# Altium project ProtoStack_Codec.PrjPcb
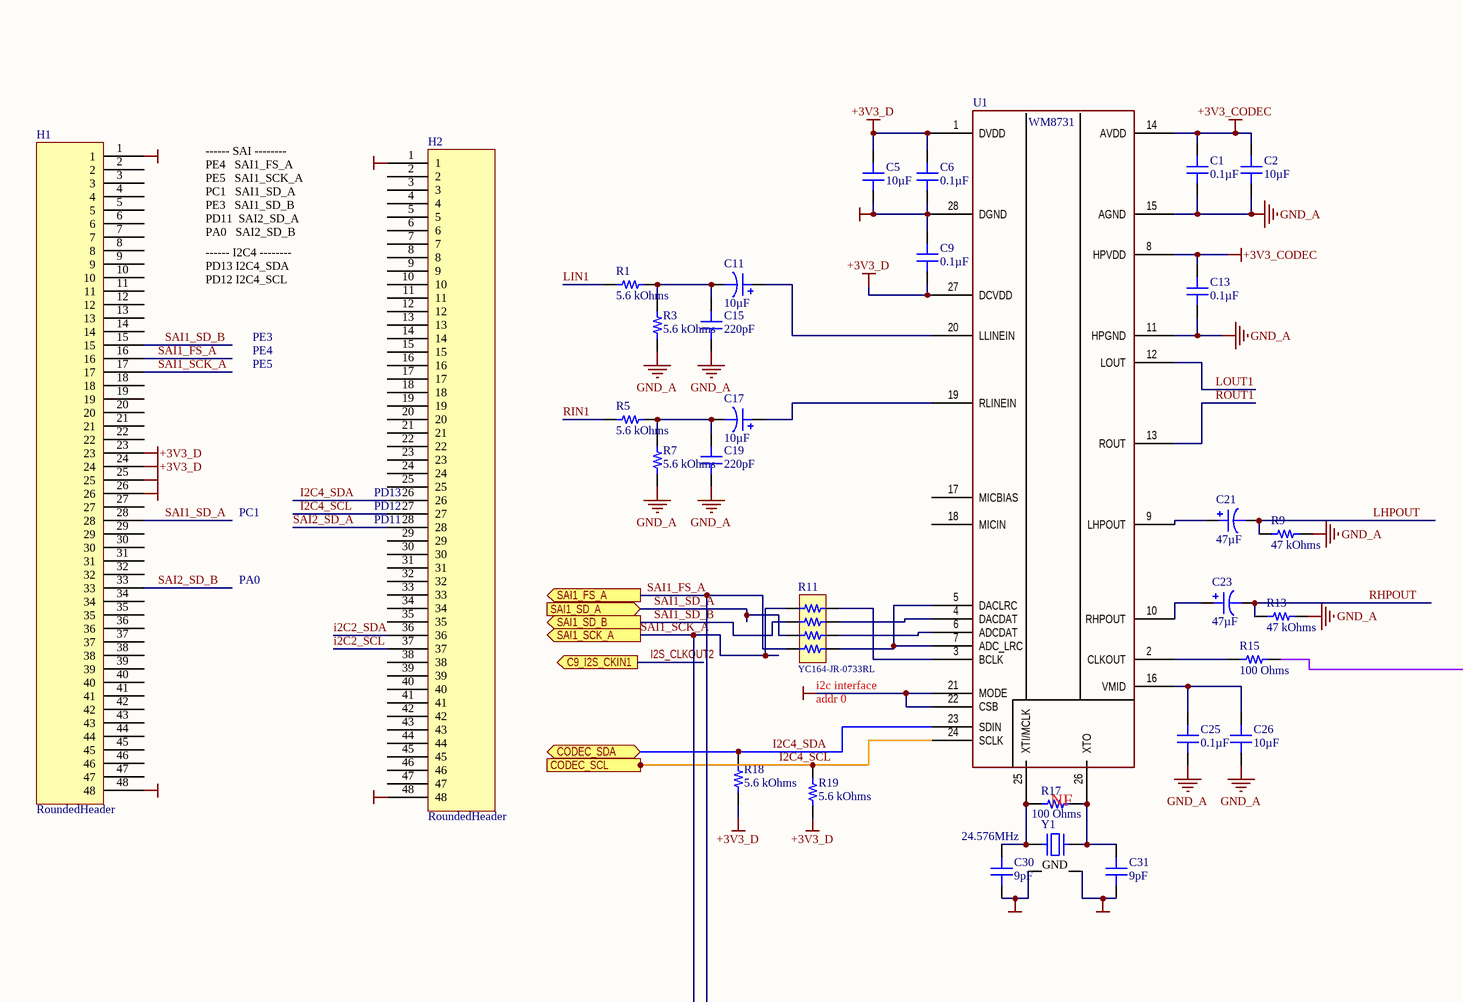
[diagram p0: ProtoStack_Codec.SchDoc, left]
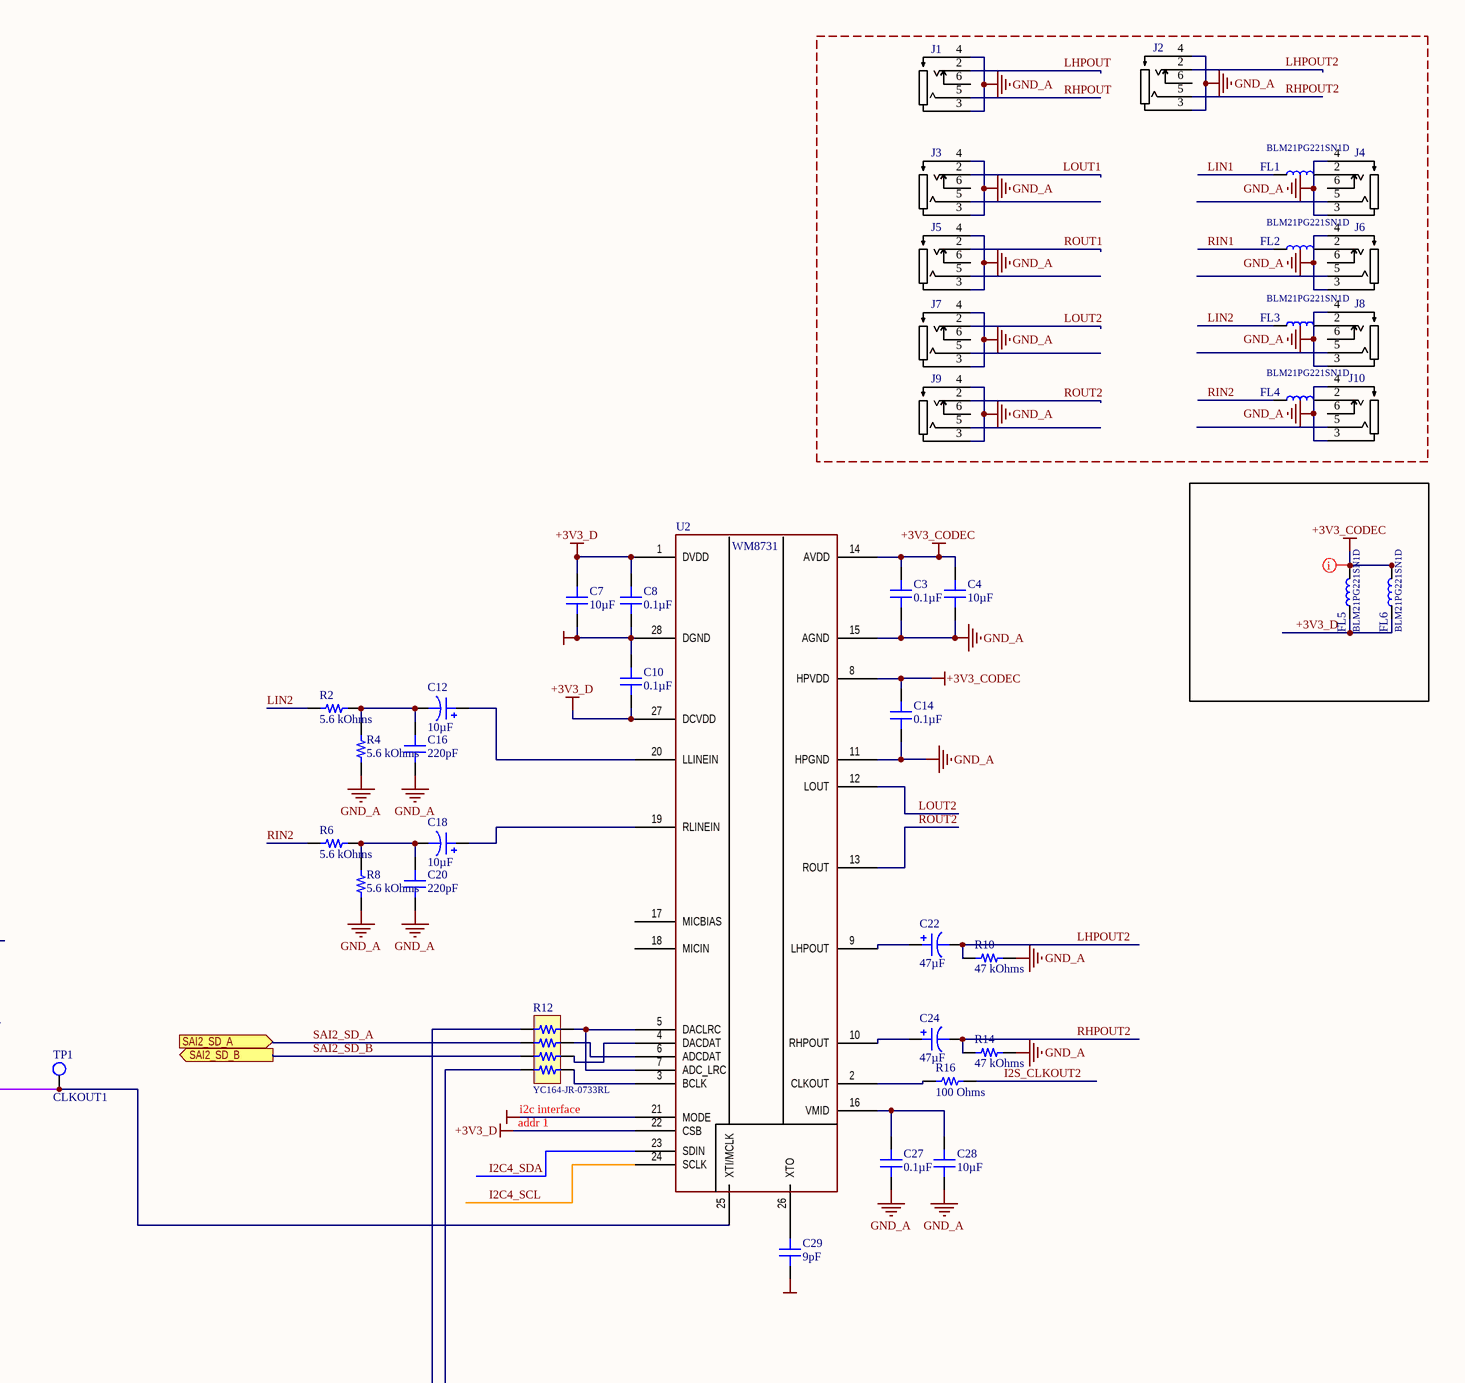
[diagram p1: ProtoStack_Codec.SchDoc, right]
1 sheet, 72 parts. Net scope: flat (ports and power ports of the same name join across sheets).
Board file: ProtoStack_Codec.PcbDoc

## Sheet ProtoStack_Codec.SchDoc
size A2; SheetNumber: 1; SheetTotal: 1

### Parts
C1  0.1µF  [CAP 0402_1005]
C2  10µF  [CAP 0805_2012]
C3  0.1µF  [CAP 0402_1005]
C4  10µF  [CAP 0805_2012]
C5  10µF  [CAP 0805_2012]
C6  0.1µF  [CAP 0402_1005]
C7  10µF  [CAP 0805_2012]
C8  0.1µF  [CAP 0402_1005]
C9  0.1µF  [CAP 0402_1005]
C10  0.1µF  [CAP 0402_1005]
C11  10µF  [CAP POL 1206_3216]
C12  10µF  [CAP POL 1206_3216]
C13  0.1µF  [CAP 0402_1005]
C14  0.1µF  [CAP 0402_1005]
C15  220pF  [CAP 0603_1608]
C16  220pF  [CAP 0603_1608]
C17  10µF  [CAP POL 1206_3216]
C18  10µF  [CAP POL 1206_3216]
C19  220pF  [CAP 0603_1608]
C20  220pF  [CAP 0603_1608]
C21  47µF  [CAP POL 2917_7343]
C22  47µF  [CAP POL 2917_7343]
C23  47µF  [CAP POL 2917_7343]
C24  47µF  [CAP POL 2917_7343]
C25  0.1µF  [CAP 0402_1005]
C26  10µF  [CAP 0805_2012]
C27  0.1µF  [CAP 0402_1005]
C28  10µF  [CAP 0805_2012]
C29  9pF  [CAP 0805_2012]
C30  9pF  [CAP 0805_2012]
C31  9pF  [CAP 0805_2012]
FL1  BLM21PG221SN1D  [0805_IND]
FL2  BLM21PG221SN1D  [0805_IND]
FL3  BLM21PG221SN1D  [0805_IND]
FL4  BLM21PG221SN1D  [0805_IND]
FL5  BLM21PG221SN1D  [0805_IND]
FL6  BLM21PG221SN1D  [0805_IND]
H1  RoundedHeader  [HeaderDtack_48]
H2  RoundedHeader  [HeaderDtack_48]
J1  (no value)  [PJ_327]
J2  (no value)  [PJ_327]
J3  (no value)  [PJ_327]
J4  (no value)  [PJ_327]
J5  (no value)  [PJ_327]
J6  (no value)  [PJ_327]
J7  (no value)  [PJ_327]
J8  (no value)  [PJ_327]
J9  (no value)  [PJ_327]
J10  (no value)  [PJ_327]
R1  5.6 kOhms  [RES 0603_1608]
R2  5.6 kOhms  [RES 0603_1608]
R3  5.6 kOhms  [RES 0603_1608]
R4  5.6 kOhms  [RES 0603_1608]
R5  5.6 kOhms  [RES 0603_1608]
R6  5.6 kOhms  [RES 0603_1608]
R7  5.6 kOhms  [RES 0603_1608]
R8  5.6 kOhms  [RES 0603_1608]
R9  47 kOhms  [RES 0603_1608]
R10  47 kOhms  [RES 0603_1608]
R11  YC164-JR-0733RL  [RESNET 1206-8 CONVEX]
R12  YC164-JR-0733RL  [RESNET 1206-8 CONVEX]
R13  47 kOhms  [RES 0603_1608]
R14  47 kOhms  [RES 0603_1608]
R15  100 Ohms  [RES 0402_1005]
R16  100 Ohms  [RES 0402_1005]
R17  100 Ohms  [RES 0402_1005]
R18  5.6 kOhms  [RES 0603_1608]
R19  5.6 kOhms  [RES 0603_1608]
TP1  CLKOUT1  [TESTPOINT]  (no BOM)
U1  WM8731  [TSSOP-28]
U2  WM8731  [TSSOP-28]
Y1  24.576MHz  [ABRACON ABM8G]

### Ports
C9_I2S_CKIN1 (out), CODEC_SCL (in), CODEC_SDA (bidir), SAI1_FS_A (out), SAI1_SCK_A (out), SAI1_SD_A (in), SAI1_SD_B (out), SAI2_SD_A (in), SAI2_SD_B (out)

### Nets
+3V3_CODEC: C1.2 C2.2 C3.2 C4.2 C13.2 C14.2 FL5.2 FL6.2 U1.8(HPVDD) U1.14(AVDD) U2.8(HPVDD) U2.14(AVDD)
+3V3_D: C5.2 C6.2 C7.2 C8.2 C9.1 C10.1 FL5.1 FL6.1 H1.23 H1.24 R18.1 R19.1 U1.1(DVDD) U1.27(DCVDD) U2.1(DVDD) U2.22(CSB) U2.27(DCVDD)
GND: C5.1 C6.1 C7.1 C8.1 C9.2 C10.2 C29.2 C30.2 C31.2 H1.1 H1.25 H1.26 H1.48 H2.1 H2.48 U1.21(MODE) U1.22(CSB) U1.28(DGND) U2.21(MODE) U2.28(DGND) Y1.2(GND) Y1.4(GND)
GND_A: C1.1 C2.1 C3.1 C4.1 C13.1 C14.1 C15.1 C16.1 C19.1 C20.1 C25.2 C26.2 C27.2 C28.2 J1.3 J1.4 J2.3 J2.4 J3.3 J3.4 J4.3 J4.4 J5.3 J5.4 J6.3 J6.4 J7.3 J7.4 J8.3 J8.4 J9.3 J9.4 J10.3 J10.4 R3.1 R4.1 R7.1 R8.1 R9.2 R10.2 R13.2 R14.2 U1.11(HPGND) U1.15(AGND) U2.11(HPGND) U2.15(AGND)
i2C2_SCL: H2.37
i2C2_SDA: H2.36
I2C4_SCL: H2.27 R19.2 U1.24(SCLK) U2.24(SCLK) ; port CODEC_SCL
I2C4_SDA: H2.26 R18.2 U1.23(SDIN) U2.23(SDIN) ; port CODEC_SDA
I2S_CLKOUT2: R16.2 ; port C9_I2S_CKIN1
LHPOUT: C21.2 J1.2 R9.1
LHPOUT2: C22.2 J2.2 R10.1
LIN1: FL1.1 R1.1
LIN2: FL3.1 R2.1
LOUT1: J3.2 U1.12(LOUT)
LOUT2: J7.2 U2.12(LOUT)
RHPOUT: C23.2 J1.5 R13.1
RHPOUT2: C24.2 J2.5 R14.1
RIN1: FL2.1 R5.1
RIN2: FL4.1 R6.1
ROUT1: J5.2 U1.13(ROUT)
ROUT2: J9.2 U2.13(ROUT)
SAI1_FS_A: H1.16 R11.4 R12.1 ; port SAI1_FS_A
SAI1_SCK_A: H1.17 R11.1 R12.4 ; port SAI1_SCK_A
SAI1_SD_A: H1.28 R11.3 ; port SAI1_SD_A
SAI1_SD_B: H1.15 R11.2 ; port SAI1_SD_B
SAI2_SD_A: H2.28 R12.2 ; port SAI2_SD_A
SAI2_SD_B: H1.33 R12.3 ; port SAI2_SD_B
NetC11_1: C11.1 U1.20(LLINEIN)
NetC11_2: C11.2 C15.2 R1.2 R3.2
NetC12_1: C12.1 U2.20(LLINEIN)
NetC12_2: C12.2 C16.2 R2.2 R4.2
NetC17_1: C17.1 U1.19(RLINEIN)
NetC17_2: C17.2 C19.2 R5.2 R7.2
NetC18_1: C18.1 U2.19(RLINEIN)
NetC18_2: C18.2 C20.2 R6.2 R8.2
NetC21_1: C21.1 U1.9(LHPOUT)
NetC22_1: C22.1 U2.9(LHPOUT)
NetC23_1: C23.1 U1.10(RHPOUT)
NetC24_1: C24.1 U2.10(RHPOUT)
NetC25_1: C25.1 C26.1 U1.16(VMID)
NetC27_1: C27.1 C28.1 U2.16(VMID)
NetC29_1: C29.1 U2.26(XTO)
NetC30_1: C30.1 R17.1 U1.25(XTI/MCLK) Y1.1
NetC31_1: C31.1 R17.2 U1.26(XTO) Y1.3
NetFL1_2: FL1.2 J4.2
NetFL2_2: FL2.2 J6.2
NetFL3_2: FL3.2 J8.2
NetFL4_2: FL4.2 J10.2
NetR11_5: R11.5 U1.5(DACLRC) U1.7(ADC_LRC)
NetR11_6: R11.6 U1.6(ADCDAT)
NetR11_7: R11.7 U1.4(DACDAT)
NetR11_8: R11.8 U1.3(BCLK)
NetR12_5: R12.5 U2.3(BCLK)
NetR12_6: R12.6 U2.4(DACDAT)
NetR12_7: R12.7 U2.6(ADCDAT)
NetR12_8: R12.8 U2.5(DACLRC) U2.7(ADC_LRC)
NetR15_1: R15.1 U1.2(CLKOUT)
NetR15_2: R15.2 TP1.1 U2.25(XTI/MCLK)
NetR16_1: R16.1 U2.2(CLKOUT)

Not connected (* = marked no-connect by the designer): H1 2 3 4 5 6 7 8 9 10 11 12 13 14 18 19 20 21 22 27 29 30 31 32 34 35 36 37 38 39 40 41 42 43 44 45 46 47; H2 2 3 4 5 6 7 8 9 10 11 12 13 14 15 16 17 18 19 20 21 22 23 24 25 29 30 31 32 33 34 35 38 39 40 41 42 43 44 45 46 47; J1 6(4); J2 6(4); J3 5(3) 6(4); J4 5(3) 6(4); J5 5(3) 6(4); J6 5(3) 6(4); J7 5(3) 6(4); J8 5(3) 6(4); J9 5(3) 6(4); J10 5(3) 6(4); U1 17(MICBIAS) 18(MICIN); U2 17(MICBIAS) 18(MICIN)

### Layout directives
net class PowerNet: +3V3_CODEC

### Notes on the sheet
- ------ SAI --------
  PE4  	SAI1_FS_A
  PE5  	SAI1_SCK_A
  PC1  	SAI1_SD_A
  PE3  	SAI1_SD_B
  PD11 	SAI2_SD_A
  PA0  	SAI2_SD_B
- ------ I2C4 --------
  PD13	I2C4_SDA
  PD12	I2C4_SCL
- PE3
- PE4
- PE5
- PC1
- (near H2) PD11
- (near H2) PD12
- (near H2) PD13
- PA0
- (near R11) i2c interface
- (near R11) addr 0
- (near R12) addr 1
- (near R12) i2c interface
- (near R17) NF

### Library data of the parts
C1 C3 C6 C8-C10 C13 C14 C25 C27 = C0402C104K4RACAUTO: CAP CER 0.1UF 16V X7R 0402; Manufacturer: KEMET; Tolerance: ±10%; Part Number: C0402C104K4RACAUTO; Value: 0.1µF; Applications: Automotive, Bypass, Decoupling; Capacitance: 0.1µF; ComponentLink1Description: Datasheet; ComponentLink1URL: https://api.kemet.com/component-edge/download/specsheet/C0402C104K4RACAUTO.pdf; ComponentLink2Description: DigiKey Link; ComponentLink2URL: http://digikey.com/product-detail/en/kemet/C0402C104K4RACAUTO/399-6828-1-ND/3314343; Device Package: 0402 (1005 Metric); LastUpdated: 9/2/2020 1:02:21 AM; Lifecycle Status: Active; Minimum Order: 1; Mounting Type: Surface Mount, MLCC; Operating Temperature: -55°C ~ 125°C; Package / Case: 0402 (1005 Metric); Packaging: TapeAndReel; PartId: 3024; Part Status: Active; Price: 0.01; Ratings: AEC-Q200; Series: SMD Auto X7R; Size / Dimension: 0.039" L x 0.020" W (1.00mm x 0.50mm); Supplier 1: DigiKey; Supplier Part Number 1: 399-6828-1-ND; Temperature Coefficient: X7R; Thickness (Max): 0.022" (0.55mm); Voltage - Rated: 16V
C2 C4 C5 C7 C26 C28 = C0805C106K8PACTU: CAP CER 10UF 10V X5R 0805; Manufacturer: KEMET; Tolerance: ±10%; Part Number: C0805C106K8PACTU; Value: 10µF; Applications: General Purpose; Capacitance: 10µF; ComponentLink1Description: Datasheet; ComponentLink1URL: https://api.kemet.com/component-edge/download/datasheet/C0805C106K8PACTU.pdf; ComponentLink2Description: DigiKey Link; ComponentLink2URL: http://digikey.com/product-detail/en/kemet/C0805C106K8PACTU/399-4925-1-ND/1090920; Device Package: 0805 (2012 Metric); LastUpdated: 9/2/2020 1:04:14 AM; Lifecycle Status: Active; Minimum Order: 1; Mounting Type: Surface Mount, MLCC; Operating Temperature: -55°C ~ 85°C; Package / Case: 0805 (2012 Metric); Packaging: TapeAndReel; PartId: 15978; Part Status: Active; Price: 0.03; Series: SMD Comm X5R; Size / Dimension: 0.079" L x 0.049" W (2.00mm x 1.25mm); Supplier 1: DigiKey; Supplier Part Number 1: 399-4925-1-ND; Temperature Coefficient: X5R; Thickness (Max): 0.055" (1.40mm); Voltage - Rated: 10V
C11 C12 C17 C18 = T491A106K010AT: CAP TANT 10UF 10% 10V 1206; Manufacturer: KEMET; Manufacturer Size Code: A; ESR (Equivalent Series Resistance): 3.8Ohm; Lifetime @ Temp.: 2000 Hrs @ 125°C; Type: Molded; Part Number: T491A106K010AT; Value: 10µF; Capacitance: 10µF; ComponentLink1Description: Datasheet; ComponentLink1URL: https://api.kemet.com/component-edge/download/datasheet/T491A106K010AT.pdf; ComponentLink2Description: DigiKey Link; ComponentLink2URL: http://digikey.com/product-detail/en/kemet/T491A106K010AT/399-3684-1-ND/819009; Device Package: 1206 (3216 Metric); Features: General Purpose; Height - Seated (Max): 0.071" (1.80mm); LastUpdated: 9/2/2020 1:15:58 AM; Lifecycle Status: Active; Minimum Order: 1; Mounting Type: Surface Mount; Operating Temperature: -55°C ~ 125°C; Package / Case: 1206 (3216 Metric); Packaging: TapeAndReel; PartId: 330; Part Status: Active; Price: 0.07; Series: T491; Size / Dimension: 0.126" L x 0.063" W (3.20mm x 1.60mm); Supplier 1: DigiKey; Supplier Part Number 1: 399-3684-1-ND; Tolerance: ±10%; Voltage - Rated: 10V
C15 C16 C19 C20 = C0603C221K5RACTU: CAP CER 220PF 50V X7R 0603; Manufacturer: KEMET; Tolerance: ±10%; Part Number: C0603C221K5RACTU; Value: 220pF; Applications: Bypass, Decoupling; Capacitance: 220pF; ComponentLink1Description: Datasheet; ComponentLink1URL: https://api.kemet.com/component-edge/download/datasheet/C0603C221K5RACTU.pdf; ComponentLink2Description: DigiKey Link; ComponentLink2URL: http://digikey.com/product-detail/en/kemet/C0603C221K5RACTU/399-1071-1-ND/411346; Device Package: 0603 (1608 Metric); LastUpdated: 9/2/2020 1:03:33 AM; Lifecycle Status: Active; Minimum Order: 1; Mounting Type: Surface Mount, MLCC; Operating Temperature: -55°C ~ 125°C; Package / Case: 0603 (1608 Metric); Packaging: TapeAndReel; PartId: 3639; Part Status: Active; Price: 0.01; Series: SMD Comm X7R; Size / Dimension: 0.063" L x 0.031" W (1.60mm x 0.80mm); Supplier 1: DigiKey; Supplier Part Number 1: 399-1071-1-ND; Temperature Coefficient: X7R; Thickness (Max): 0.034" (0.87mm); Voltage - Rated: 50V
C21-C24 = 293D476X9010D2TE3: CAP TANT 47UF 10% 10V 2917; Manufacturer: Vishay Sprague; Manufacturer Size Code: D; ESR (Equivalent Series Resistance): 700mOhm; Type: Molded; Part Number: 293D476X9010D2TE3; Value: 47µF; Capacitance: 47µF; ComponentLink1Description: Datasheet; ComponentLink1URL: http://www.vishay.com/docs/40002/293d.pdf; ComponentLink2Description: DigiKey Link; ComponentLink2URL: http://digikey.com/product-detail/en/vishay-sprague/293D476X9010D2TE3/718-1088-1-ND/1559582; Device Package: 2917 (7343 Metric); Features: General Purpose; Height - Seated (Max): 0.122" (3.10mm); LastUpdated: 9/2/2020 1:16:14 AM; Lifecycle Status: Active; Minimum Order: 1; Mounting Type: Surface Mount; Operating Temperature: -55°C ~ 125°C; Package / Case: 2917 (7343 Metric); Packaging: TapeAndReel; PartId: 2778; Part Status: Active; Price: 0.22; Series: TANTAMOUNT®, 293D; Size / Dimension: 0.287" L x 0.169" W (7.30mm x 4.30mm); Supplier 1: DigiKey; Supplier Part Number 1: 718-1088-1-ND; Tolerance: ±10%; Voltage - Rated: 10V
C29-C31 = CBR08C909CAGAC: CAP CER 9PF 250V C0G/NP0 0805; Manufacturer: KEMET; Temperature Coefficient: C0G, NP0; Tolerance: ±0.25pF; Part Number: CBR08C909CAGAC; Value: 9pF; Applications: RF, Microwave, High Frequency; Capacitance: 9pF; ComponentLink1Description: Datasheet; ComponentLink1URL: https://api.kemet.com/component-edge/download/datasheet/CBR08C909CAGAC.pdf; ComponentLink2Description: DigiKey Link; ComponentLink2URL: http://digikey.com/product-detail/en/kemet/CBR08C909CAGAC/399-8711-1-ND/3480335; Device Package: 0805 (2012 Metric); Features: High Q, Low Loss, Ultra Low ESR; LastUpdated: 9/2/2020 1:04:31 AM; Lifecycle Status: Active; Minimum Order: 1; Mounting Type: Surface Mount, MLCC; Operating Temperature: -55°C ~ 125°C; Package / Case: 0805 (2012 Metric); Packaging: TapeAndReel; PartId: 8592; Part Status: Active; Price: 0.28; Series: CBR-SMD RF C0G; Size / Dimension: 0.079" L x 0.049" W (2.00mm x 1.25mm); Supplier 1: DigiKey; Supplier Part Number 1: 399-8711-1-ND; Thickness (Max): 0.035" (0.88mm); Voltage - Rated: 250V
FL1-FL6 = BLM21PG221SN1D: ACM Series 0805 360 Ohm 220mA 500 mOhm DCR 50 V SMT Common Mode Filter
H1 H2 = HeaderStack_48
J1-J10 = 3.5mm jack stereo smd: Conn 3.5MM Stereo Jack F 3 POS Solder RA SMD 3 Terminal 1 Port T/R; MP: 35RASMT2BHNTRX; MF: Switchcraft; Package: None; Price: 0.84 USD; Availability: Good; SnapEDA_Link: https://www.snapeda.com/parts/35RASMT2BHNTRX/Switchcraft%20Inc./view-part/?ref=snap; Value: *
R1-R8 R18 R19 = RT0603DRE075K6L: RES SMD 5.6K OHM 0.5% 1/10W 0603; Manufacturer: Yageo; Power (Watts): 0.1W, 1/10W; Temperature Coefficient: ±50ppm/°C; Part Number: RT0603DRE075K6L; Value: 5.6 kOhms; ComponentLink1Description: Datasheet; ComponentLink1URL: https://www.yageo.com/upload/media/product/productsearch/datasheet/rchip/PYu-RT_1-to-0.01_RoHS_L_11.pdf; ComponentLink2Description: DigiKey Link; ComponentLink2URL: http://digikey.com/product-detail/en/yageo/RT0603DRE075K6L/311-2635-1-ND/6129054; Composition: Thin Film; Device Package: 0603 (1608 Metric); Height - Seated (Max): 0.022" (0.55mm); LastUpdated: 9/2/2020 1:10:05 AM; Lifecycle Status: Active; Minimum Order: 1; Number of Terminations: 2; Operating Temperature: -55°C ~ 155°C; Package / Case: 0603 (1608 Metric); Packaging: TapeAndReel; PartId: 14197; Part Status: Active; Price: 0.01; Resistance: 5.6 kOhms; Series: RT; Size / Dimension: 0.063" L x 0.031" W (1.60mm x 0.80mm); Supplier 1: DigiKey; Supplier Part Number 1: 311-2635-1-ND; Supplier Device Package: 0603; Tolerance: ±0.5%
R9 R10 R13 R14 = RT0603FRE0747KL: RES SMD 47K OHM 1% 1/10W 0603; Manufacturer: Yageo; Power (Watts): 0.1W, 1/10W; Temperature Coefficient: ±50ppm/°C; Part Number: RT0603FRE0747KL; Value: 47 kOhms; ComponentLink1Description: Datasheet; ComponentLink1URL: https://www.yageo.com/upload/media/product/productsearch/datasheet/rchip/PYu-RT_1-to-0.01_RoHS_L_11.pdf; ComponentLink2Description: DigiKey Link; ComponentLink2URL: http://digikey.com/product-detail/en/yageo/RT0603FRE0747KL/YAG3355CT-ND/5418060; Composition: Thin Film; Device Package: 0603 (1608 Metric); Height - Seated (Max): 0.022" (0.55mm); LastUpdated: 9/2/2020 1:10:23 AM; Lifecycle Status: Active; Minimum Order: 1; Number of Terminations: 2; Operating Temperature: -55°C ~ 155°C; Package / Case: 0603 (1608 Metric); Packaging: TapeAndReel; PartId: 5674; Part Status: Active; Price: 0.01; Resistance: 47 kOhms; Series: RT; Size / Dimension: 0.063" L x 0.031" W (1.60mm x 0.80mm); Supplier 1: DigiKey; Supplier Part Number 1: YAG3355CT-ND; Supplier Device Package: 0603; Tolerance: ±1%
R11 R12 = YC164-JR-0733RL: RES ARRAY 4 RES 33 OHM 1206; Manufacturer: Yageo; Circuit Type: Isolated; Number of Resistors: 4; Power Per Element: 62.5mW; Resistance (Ohms): 33; Temperature Coefficient: ±200ppm/°C; Tolerance: ±5%; Part Number: YC164-JR-0733RL; Applications: DDRAM, SDRAM; ComponentLink1Description: Datasheet; ComponentLink1URL: https://www.yageo.com/upload/media/product/productsearch/datasheet/rchip/PYu-YC_TC_group_51_RoHS_L_9.pdf; ComponentLink2Description: DigiKey Link; ComponentLink2URL: http://digikey.com/product-detail/en/yageo/YC164-JR-0733RL/YC164J-33CT-ND/1005642; Height - Seated (Max): 0.028" (0.70mm); LastUpdated: 9/2/2020 1:23:24 AM; Lifecycle Status: Active; Minimum Order: 1; Mounting Type: Surface Mount; Number of Pins: 8; Operating Temperature: -55°C ~ 155°C; Package / Case: 1206 (3216 Metric), Convex, Long Side Terminals; Packaging: TapeAndReel; PartId: 145; Part Status: Active; Price: 0.01; Series: YC164; Size / Dimension: 0.126" L x 0.063" W (3.20mm x 1.60mm); Supplier 1: DigiKey; Supplier Part Number 1: YC164J-33CT-ND
R15-R17 = RT0402FRE07100RL: RES SMD 100 OHM 1% 1/16W 0402; Manufacturer: Yageo; Power (Watts): 0.063W, 1/16W; Temperature Coefficient: ±50ppm/°C; Part Number: RT0402FRE07100RL; Value: 100 Ohms; ComponentLink1Description: Datasheet; ComponentLink1URL: https://www.yageo.com/upload/media/product/productsearch/datasheet/rchip/PYu-RT_1-to-0.01_RoHS_L_11.pdf; ComponentLink2Description: DigiKey Link; ComponentLink2URL: http://digikey.com/product-detail/en/yageo/RT0402FRE07100RL/YAG3342CT-ND/5418047; Composition: Thin Film; Device Package: 0402 (1005 Metric); Height - Seated (Max): 0.014" (0.35mm); LastUpdated: 9/2/2020 1:08:09 AM; Lifecycle Status: Active; Minimum Order: 1; Number of Terminations: 2; Operating Temperature: -55°C ~ 155°C; Package / Case: 0402 (1005 Metric); Packaging: TapeAndReel; PartId: 3193; Part Status: Active; Price: 0.01; Resistance: 100 Ohms; Series: RT; Size / Dimension: 0.039" L x 0.020" W (1.00mm x 0.50mm); Supplier 1: DigiKey; Supplier Part Number 1: YAG3342CT-ND; Supplier Device Package: 0402; Tolerance: ±1%
TP1 = TestPoint
U1 U2 = WM8731: Stero in/ot audio codec
Y1 = ABM8G-24.576MHZ-B4Y-T: CRYSTAL 24.5760MHZ 10PF SMD; Manufacturer: Abracon LLC; ESR (Equivalent Series Resistance): 60 Ohms; Frequency Stability: ±30ppm; Operating Mode: Fundamental; Part Number: ABM8G-24.576MHZ-B4Y-T; ComponentLink1Description: Datasheet; ComponentLink1URL: https://abracon.com/Resonators/ABM8G.pdf; ComponentLink2Description: DigiKey Link; ComponentLink2URL: http://digikey.com/product-detail/en/abracon-llc/ABM8G-24.576MHZ-B4Y-T/535-10296-1-ND/2218109; Device Package: 4-SMD, No Lead; Frequency: 24.576MHz; Frequency Tolerance: ±30ppm; Height - Seated (Max): 0.039" (1.00mm); LastUpdated: 3/19/2020 10:36:25 PM; Lifecycle Status: Active; Load Capacitance: 10pF; Minimum Order: 1; Mounting Type: Surface Mount; Operating Temperature: -20°C ~ 70°C; Package / Case: 4-SMD, No Lead; Packaging: TapeAndReel; PartId: 297; Part Status: Active; Price: 0.50; Series: ABM8G; Size / Dimension: 0.126" L x 0.098" W (3.20mm x 2.50mm); Supplier 1: DigiKey; Supplier Part Number 1: 535-10296-1-ND; Type: MHz Crystal; Value: 24.576MHz